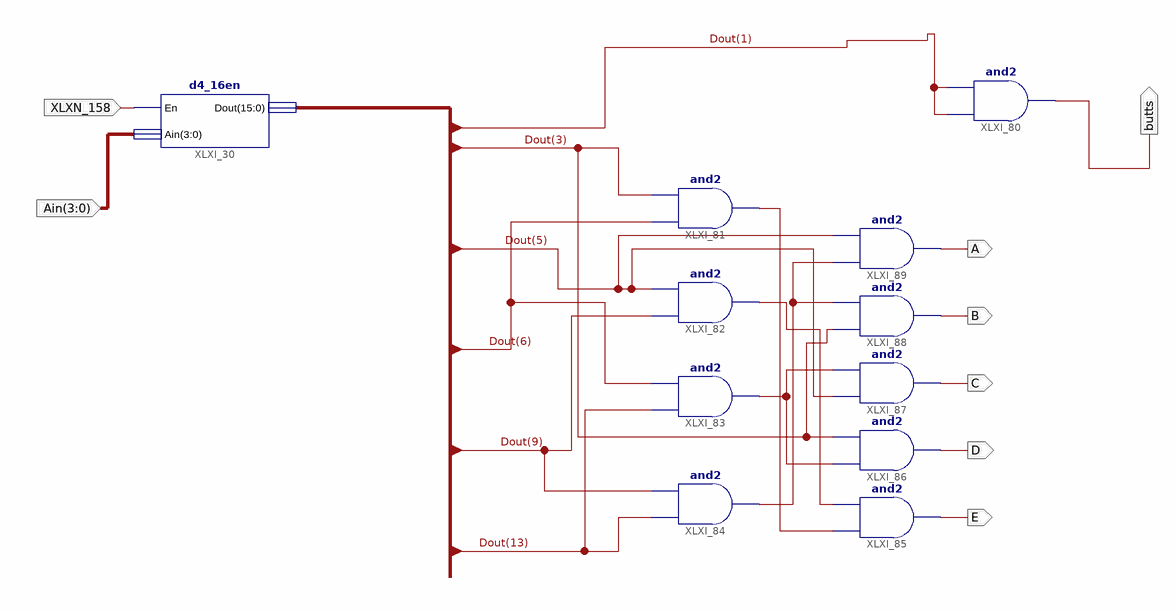
[diagram p0: schematic sheet 1]
// Xilinx ISE schematic experiment1.sch (spartan3e) as structural Verilog: 11 symbols, 8 ports
module experiment1 (
  input  [3:0] Ain,
  input  XLXN_158,
  output A,
  output B,
  output C,
  output D,
  output E,
  output butts
);

  wire XLXN_174, XLXN_176, XLXN_177, XLXN_178;
  wire [15:0] Dout;

  d4_16en XLXI_30 (.En(XLXN_158), .Ain(Ain), .Dout(Dout));
  and XLXI_80 (butts, Dout[1], Dout[1]);
  and XLXI_81 (XLXN_178, Dout[6], Dout[3]);
  and XLXI_82 (XLXN_177, Dout[9], Dout[5]);
  and XLXI_83 (XLXN_176, Dout[13], Dout[6]);
  and XLXI_84 (XLXN_174, Dout[13], Dout[9]);
  and XLXI_85 (E, XLXN_178, XLXN_177);
  and XLXI_86 (D, XLXN_176, Dout[3]);
  and XLXI_87 (C, Dout[5], XLXN_176);
  and XLXI_88 (B, Dout[3], XLXN_174);
  and XLXI_89 (A, XLXN_174, Dout[5]);
endmodule
